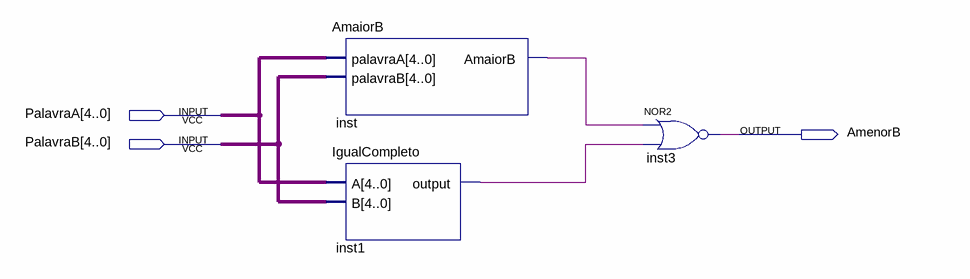
[diagram p0: schematic sheet]
// Quartus schematic AmenorB.bdf as structural Verilog: 3 symbols, 3 pins
module AmenorB (
  input  [4:0] PalavraA,
  input  [4:0] PalavraB,
  output AmenorB
);

  wire inst1_output, inst_amaiorb;

  AmaiorB inst (.palavraA(PalavraA), .palavraB(PalavraB), .AmaiorB(inst_amaiorb));
  IgualCompleto inst1 (.A(PalavraA), .B(PalavraB), .\output (inst1_output));
  nor inst3 (AmenorB, inst_amaiorb, inst1_output);
endmodule
